# Altium schematic sheet POWER.SchDoc
size A4; SheetNumber: 2
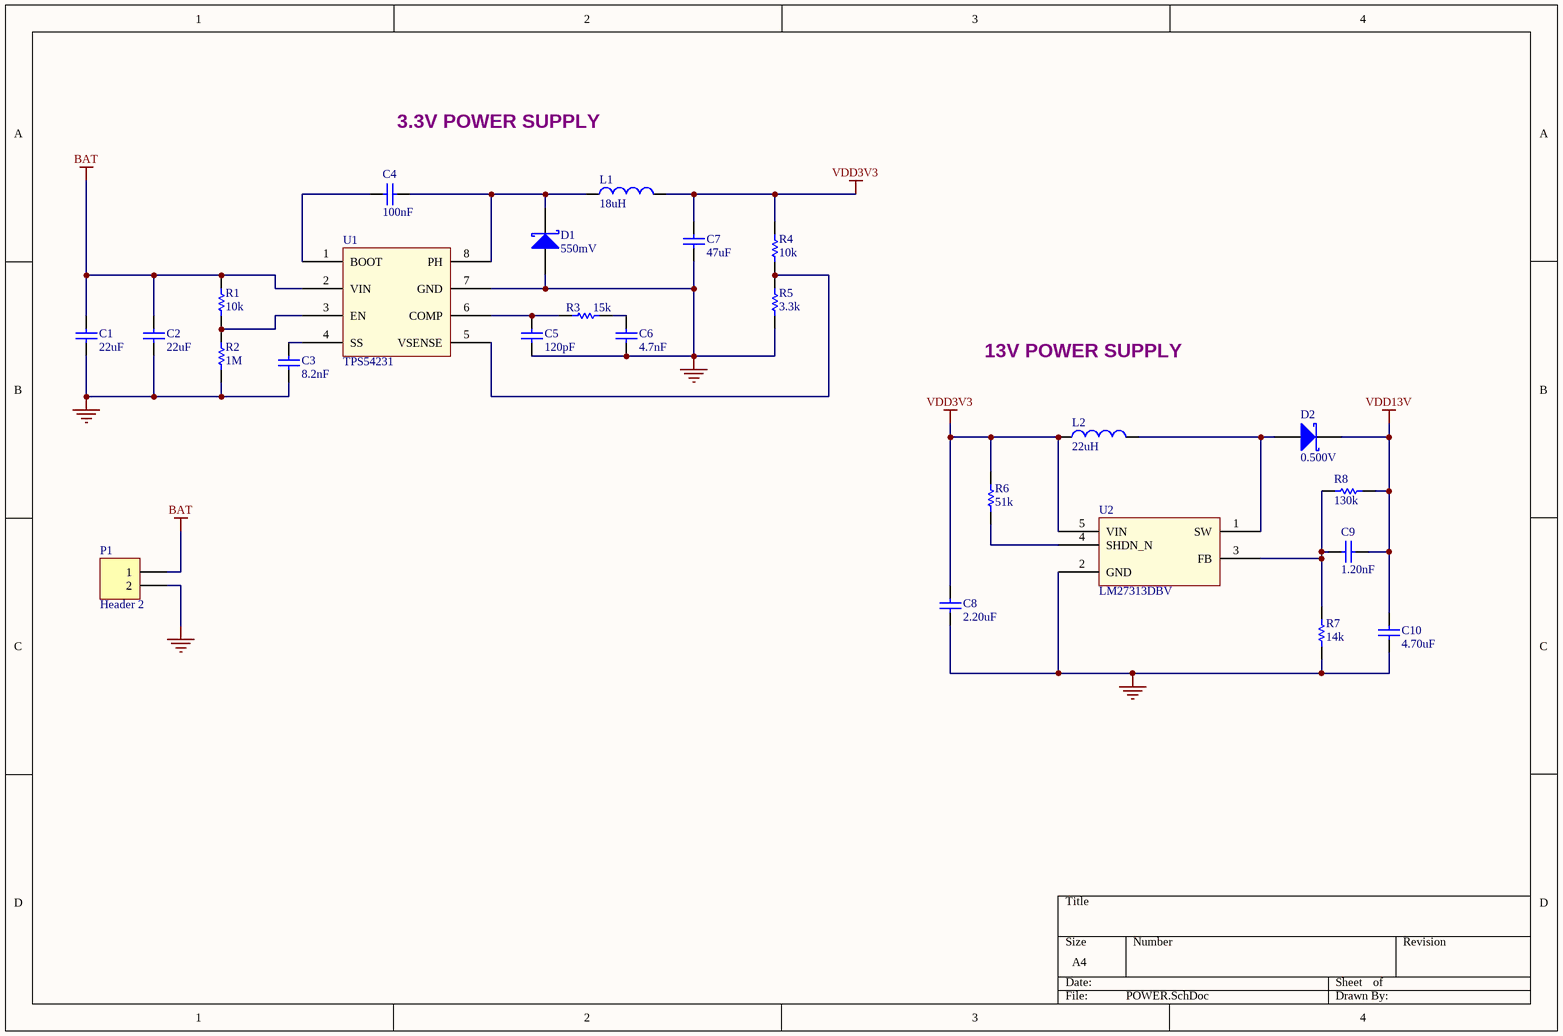
[diagram p0: POWER.SchDoc]

## Parts
C1  22uF  [CAPC1608X90N]
C2  22uF  [CAPC1608X90N]
C3  8.2nF  [CAPC1608X90N]
C4  100nF  [CAPC1608X90N]
C5  120pF  [CAPC1608X90N]
C6  4.7nF  [CAPC1608X90N]
C7  47uF  [CAPMP7343X310N]
C8  2.20uF  [CAPC1608X90N]
C9  1.20nF  [CAPC1608X90N]
C10  4.70uF  [CAPC1608X90N]
D1  550mV  [SOD123]
D2  0.500V  [SOD123]
L1  18uH  [SD43 Inductor]
L2  22uH  [ME3220 Inductor]
P1  Header 2  [2477]
R1  10k  [RESC1608X55N]
R2  1M  [RESC1608X55N]
R3  15k  [RESC1608X55N]
R4  10k  [RESC1608X55N]
R5  3.3k  [RESC1608X55N]
R6  51k  [RESC1608X55N]
R7  14k  [RESC1608X55N]
R8  130k  [RESC1608X55N]
U1  TPS54231  [SOIC-8]
U2  LM27313DBV  [SOT23-5]

## Nets
BAT: C1.2 C2.2 P1.1 R1.1 U1.2(VIN)
GND: C1.1 C2.1 C3.1 C5.1 C6.1 C7.1 C8.1 C10.1 D1.1(A) P1.2 R2.2 R5.1 R7.1 U1.7(GND) U2.2(GND)
VDD3V3: C7.2 C8.2 L1.2 L2.1 R4.2 R6.2 U2.5(VIN)
VDD13V: C9.2 C10.2 D2.2(K) R8.2
NetC3_2: C3.2 U1.4(SS)
NetC4_1: C4.1 D1.2(K) L1.1 U1.8(PH)
NetC4_2: C4.2 U1.1(BOOT)
NetC5_2: C5.2 R3.2 U1.6(COMP)
NetC6_2: C6.2 R3.1
NetC9_1: C9.1 R7.2 R8.1 U2.3(FB)
NetD2_1: D2.1(A) L2.2 U2.1(SW)
NetR1_2: R1.2 R2.1 U1.3(EN)
NetR4_1: R4.1 R5.2 U1.5(VSENSE)
NetR6_1: R6.1 U2.4(SHDN_N)

## Notes on the sheet
- 3.3V POWER SUPPLY
- 13V POWER SUPPLY

## Library data of the parts
C1 C2 = Capacitor: 50V; Fabricant: MURATA; Fournisseur: Farnell; Fournisseur_REF: 2672212; Fabricant_REF: GRT31CR61E226KE01L; Price: 1,33
C3 C6 = Capacitor: 25V; Fabricant: MURATA; Fournisseur: Farnell
C4 = Capacitor: 10V; Fabricant: MURATA; Fournisseur: Farnell
C5 C9 = Capacitor: 50V; Fabricant: MURATA; Fournisseur: Farnell
C7 = Capacitor: GRM32ER60J476ME20L 3225 !; Fabricant: KEMET; Fournisseur: Farnell; Fournisseur_REF: 1457517; Fabricant_REF: T491D476K025AT; Price: 1.9
C8 = Capacitor: 6.3V; Fabricant: MURATA; Fournisseur: Farnell
C10 = Capacitor: Fabricant: MURATA; Fournisseur: Farnell
D1 = D_ZENER: Diode; Fabricant: ON SEMICONDUCTOR; Fabricant_REF: SS24FL; Fournisseur: Farnell; Fournisseur_REF: 2822566; Price: 0.297
D2 = D_ZENER: Diode; Fabricant: DIODES INC; Fabricant_REF: B130LAW-7-F; Fournisseur: Farnell; Fournisseur_REF: 1858617; Price: 0.302
L1 = Inductor: Fabricant: COILCRAFT; Fournisseur: Farnell; Fournisseur_REF: 2526954; Fabricant_REF: SD43-183MLB; Price: 0.921
L2 = Inductor: Fabricant: COILCRAFT; Fabricant_REF: ME3220-223KLB; Fournisseur: Farnell; Fournisseur_REF: 2287928; Price: 0.661
P1 = Header 2: Header, 2-Pin; Fabricant: KEYSTONE; Fournisseur: Farnell; Fournisseur_REF: 1650684; Fabricant_REF: 2477; Price: 1.41
R1-R6 R8 = Resistor: Fabricant: MULTICOMP; Fournisseur: Farnell
R7 = Resistor: Fabricant: MULTICOMP; Fournisseur: Farnell; Fournisseur_REF: 2447252; Fabricant_REF: MCWR06X1402FTL; Price: 0.0036
U1 = TPS54231: Fabricant: TEXAS INSTRUMENTS; Fabricant_REF: TPS54231DR; Fournisseur: Farnell; Fournisseur_REF: 2854681; Price: 1.55
U2 = LM27313DBV: Fabricant: TEXAS INSTRUMENTS; Fabricant_REF: LM27313XMF/NOPB; Fournisseur: Farnell; Fournisseur_REF: 1564771; Price: 1.27